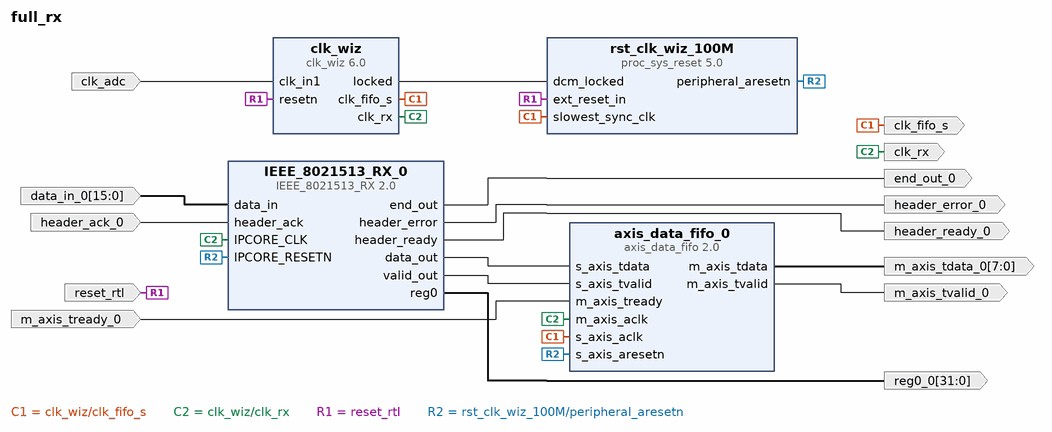
[diagram p0: block diagram of the top level]
# Vivado block design full_rx, xc7z010clg400-1, Vivado 2024.1
create_bd_design full_rx

create_bd_port -dir I -type clk clk_adc
set_property -dict {CONFIG.FREQ_HZ 125000000} [get_bd_ports clk_adc]
create_bd_port -dir I -type rst reset_rtl
set_property -dict {CONFIG.POLARITY ACTIVE_LOW} [get_bd_ports reset_rtl]
create_bd_port -dir O -from 7 -to 0 m_axis_tdata_0
create_bd_port -dir I m_axis_tready_0
create_bd_port -dir O m_axis_tvalid_0
create_bd_port -dir I -from 15 -to 0 data_in_0
create_bd_port -dir O clk_rx
create_bd_port -dir O clk_fifo_s
create_bd_port -dir O end_out_0
create_bd_port -dir I header_ack_0
create_bd_port -dir O header_ready_0
create_bd_port -dir O -from 31 -to 0 reg0_0
create_bd_port -dir O header_error_0

create_bd_cell -type ip -vlnv user.org:ip:IEEE_8021513_RX:2.0 IEEE_8021513_RX_0
create_bd_cell -type ip -vlnv xilinx.com:ip:clk_wiz:6.0 clk_wiz
set_property -dict [list \
  CONFIG.CLKIN1_JITTER_PS 80.0 \
  CONFIG.CLKOUT1_DRIVES BUFG \
  CONFIG.CLKOUT1_JITTER 125.031 \
  CONFIG.CLKOUT1_PHASE_ERROR 104.065 \
  CONFIG.CLKOUT1_REQUESTED_OUT_FREQ 125.000 \
  CONFIG.CLKOUT2_DRIVES BUFG \
  CONFIG.CLKOUT2_JITTER 189.933 \
  CONFIG.CLKOUT2_PHASE_ERROR 104.065 \
  CONFIG.CLKOUT2_REQUESTED_OUT_FREQ 15.625 \
  CONFIG.CLKOUT2_USED true \
  CONFIG.CLKOUT3_DRIVES BUFG \
  CONFIG.CLKOUT4_DRIVES BUFG \
  CONFIG.CLKOUT5_DRIVES BUFG \
  CONFIG.CLKOUT6_DRIVES BUFG \
  CONFIG.CLKOUT7_DRIVES BUFG \
  CONFIG.CLK_OUT1_PORT clk_rx \
  CONFIG.CLK_OUT2_PORT clk_fifo_s \
  CONFIG.MMCM_BANDWIDTH OPTIMIZED \
  CONFIG.MMCM_CLKFBOUT_MULT_F 7 \
  CONFIG.MMCM_CLKIN1_PERIOD 8.000 \
  CONFIG.MMCM_CLKIN2_PERIOD 10.0 \
  CONFIG.MMCM_CLKOUT0_DIVIDE_F 7 \
  CONFIG.MMCM_CLKOUT1_DIVIDE 56 \
  CONFIG.MMCM_COMPENSATION ZHOLD \
  CONFIG.MMCM_DIVCLK_DIVIDE 1 \
  CONFIG.NUM_OUT_CLKS 2 \
  CONFIG.PLL_CLKIN_PERIOD 8.000 \
  CONFIG.PRIMITIVE PLL \
  CONFIG.PRIM_IN_FREQ 125.000 \
  CONFIG.RESET_PORT resetn \
  CONFIG.RESET_TYPE ACTIVE_LOW \
] [get_bd_cells clk_wiz]
create_bd_cell -type ip -vlnv xilinx.com:ip:proc_sys_reset:5.0 rst_clk_wiz_100M
create_bd_cell -type ip -vlnv xilinx.com:ip:axis_data_fifo:2.0 axis_data_fifo_0
set_property -dict {CONFIG.FIFO_DEPTH 1024 CONFIG.IS_ACLK_ASYNC 1} [get_bd_cells axis_data_fifo_0]

# ---- connections ----

connect_bd_net [get_bd_pins IEEE_8021513_RX_0/data_out] [get_bd_pins axis_data_fifo_0/s_axis_tdata]
connect_bd_net [get_bd_pins IEEE_8021513_RX_0/end_out] [get_bd_ports end_out_0]
connect_bd_net [get_bd_pins IEEE_8021513_RX_0/header_error] [get_bd_ports header_error_0]
connect_bd_net [get_bd_pins IEEE_8021513_RX_0/header_ready] [get_bd_ports header_ready_0]
connect_bd_net [get_bd_pins IEEE_8021513_RX_0/reg0] [get_bd_ports reg0_0]
connect_bd_net [get_bd_pins IEEE_8021513_RX_0/valid_out] [get_bd_pins axis_data_fifo_0/s_axis_tvalid]
connect_bd_net [get_bd_pins axis_data_fifo_0/m_axis_tdata] [get_bd_ports m_axis_tdata_0]
connect_bd_net [get_bd_pins axis_data_fifo_0/m_axis_tvalid] [get_bd_ports m_axis_tvalid_0]
connect_bd_net -net clk_100MHz_1 [get_bd_ports clk_adc] [get_bd_pins clk_wiz/clk_in1]
connect_bd_net [get_bd_pins clk_wiz/clk_fifo_s] \
  [get_bd_ports clk_fifo_s] [get_bd_pins axis_data_fifo_0/s_axis_aclk] [get_bd_pins rst_clk_wiz_100M/slowest_sync_clk]
connect_bd_net [get_bd_pins clk_wiz/clk_rx] \
  [get_bd_ports clk_rx] [get_bd_pins axis_data_fifo_0/m_axis_aclk] [get_bd_pins IEEE_8021513_RX_0/IPCORE_CLK]
connect_bd_net [get_bd_pins clk_wiz/locked] [get_bd_pins rst_clk_wiz_100M/dcm_locked]
connect_bd_net -net data_in_0_1 [get_bd_ports data_in_0] [get_bd_pins IEEE_8021513_RX_0/data_in]
connect_bd_net -net header_ack_0_1 [get_bd_ports header_ack_0] [get_bd_pins IEEE_8021513_RX_0/header_ack]
connect_bd_net -net m_axis_tready_0_1 [get_bd_ports m_axis_tready_0] [get_bd_pins axis_data_fifo_0/m_axis_tready]
connect_bd_net [get_bd_ports reset_rtl] [get_bd_pins clk_wiz/resetn] [get_bd_pins rst_clk_wiz_100M/ext_reset_in]
connect_bd_net [get_bd_pins rst_clk_wiz_100M/peripheral_aresetn] \
  [get_bd_pins axis_data_fifo_0/s_axis_aresetn] [get_bd_pins IEEE_8021513_RX_0/IPCORE_RESETN]

validate_bd_design
save_bd_design
